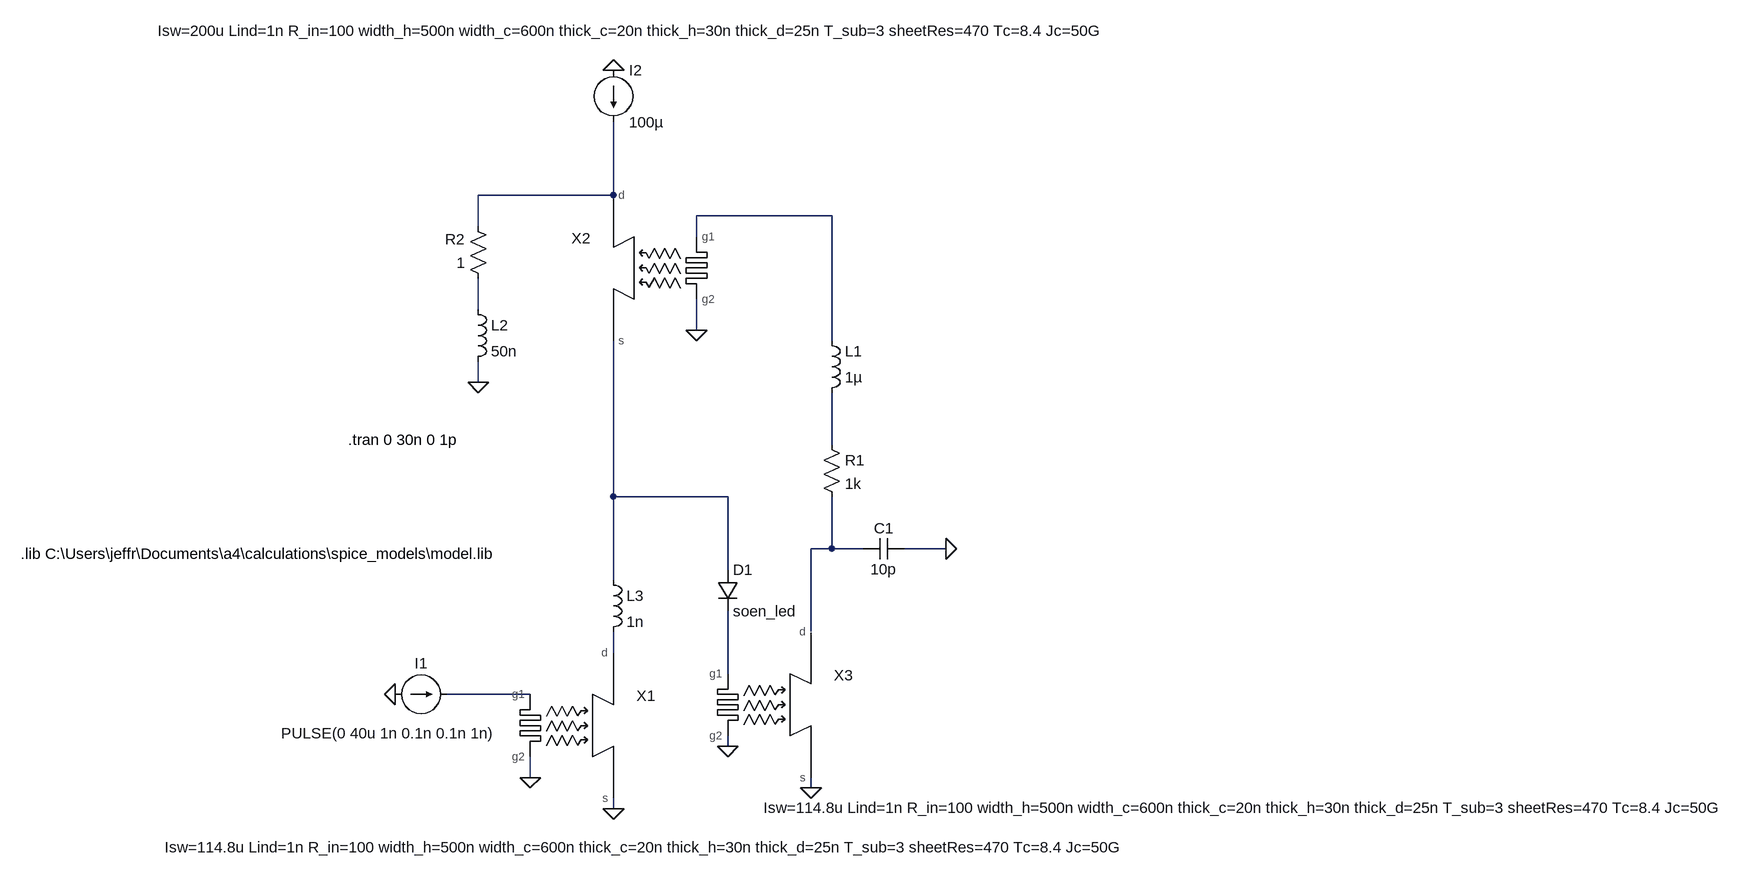
[diagram p0: schematic transmitter_hTron.asc]
transmitter_hTron.asc, the LTspice schematic file:
Version 4
SHEET 1 2100 832
WIRE 288 -448 288 -560
WIRE 288 -448 80 -448
WIRE 624 -416 416 -416
WIRE 80 -400 80 -448
WIRE 416 -384 416 -416
WIRE 80 -272 80 -320
WIRE 416 -240 416 -288
WIRE 624 -224 624 -416
WIRE 80 -160 80 -192
WIRE 624 -64 624 -144
WIRE 288 16 288 -224
WIRE 464 16 288 16
WIRE 624 96 624 16
WIRE 624 96 592 96
WIRE 672 96 624 96
WIRE 800 96 736 96
WIRE 464 128 464 16
WIRE 288 144 288 16
WIRE 592 224 592 96
WIRE 288 256 288 224
WIRE 464 288 464 192
WIRE 160 320 32 320
WIRE 464 400 464 384
WIRE 160 448 160 416
WIRE 592 464 592 448
WIRE 288 496 288 480
FLAG -48 320 0
FLAG 288 -640 0
FLAG 160 448 0
FLAG 288 496 0
FLAG 800 96 0
FLAG 416 -240 0
FLAG 80 -160 0
FLAG 464 400 0
FLAG 592 464 0
SYMBOL hTron_debug 288 368 R0
WINDOW 39 57 203 Bottom 2
SYMATTR SpiceLine Isw=114.8u Lind=1n R_in=100 width_h=500n width_c=600n thick_c=20n thick_h=30n thick_d=25n T_sub=3 sheetRes=470 Tc=8.4 Jc=50G
SYMATTR InstName X1
SYMBOL current -48 320 R270
WINDOW 0 32 40 VTop 2
WINDOW 3 -44 -10 VBottom 2
WINDOW 123 0 0 Left 0
WINDOW 39 0 0 Left 0
SYMATTR InstName I1
SYMATTR Value PULSE(0 40u 1n 0.1n 0.1n 1n)
SYMBOL current 288 -640 R0
WINDOW 123 0 0 Left 0
WINDOW 39 0 0 Left 0
SYMATTR InstName I2
SYMATTR Value 100µ
SYMBOL res 608 -80 R0
SYMATTR InstName R1
SYMATTR Value 1k
SYMBOL cap 672 112 R270
WINDOW 0 32 32 VTop 2
WINDOW 3 0 32 VBottom 2
SYMATTR InstName C1
SYMATTR Value 10p
SYMBOL ind 608 -128 M180
WINDOW 0 36 80 Left 2
WINDOW 3 36 40 Left 2
SYMATTR InstName L1
SYMATTR Value 1µ
SYMBOL hTron_debug 288 -336 M0
WINDOW 39 -36 -349 Bottom 2
SYMATTR SpiceLine Isw=200u Lind=1n R_in=100 width_h=500n width_c=600n thick_c=20n thick_h=30n thick_d=25n T_sub=3 sheetRes=470 Tc=8.4 Jc=50G
SYMATTR InstName X2
SYMBOL res 96 -304 R180
WINDOW 0 36 76 Left 2
WINDOW 3 36 40 Left 2
SYMATTR InstName R2
SYMATTR Value 1
SYMBOL ind 64 -288 R0
SYMATTR InstName L2
SYMATTR Value 50n
SYMBOL ind 272 128 R0
SYMATTR InstName L3
SYMATTR Value 1n
SYMBOL diode 448 128 R0
SYMATTR InstName D1
SYMATTR Value soen_led
SYMBOL hTron_debug 592 336 R0
WINDOW 39 674 174 Bottom 2
SYMATTR SpiceLine Isw=114.8u Lind=1n R_in=100 width_h=500n width_c=600n thick_c=20n thick_h=30n thick_d=25n T_sub=3 sheetRes=470 Tc=8.4 Jc=50G
SYMATTR InstName X3
TEXT -120 -72 Left 2 !.tran 0 30n 0 1p
TEXT -624 104 Left 2 !.lib C:\\Users\\jeffr\\Documents\\a4\\calculations\\spice_models\\model.lib

The netlist it stands for:
* transmitter_hTron.asc
XX1 N007 N009 0 0 hTron_debug params: hTron_debug Isw=114.8u Lind=1n R_in=100 width_h=500n width_c=600n thick_c=20n thick_h=30n thick_d=25n T_sub=3 sheetRes=470 Tc=8.4 Jc=50G  ; pins d g1 g2 s
I1 0 N009 PULSE(0 40u 1n 0.1n 0.1n 1n)
I2 0 N001 100µ
R1 N004 N006 1k
C1 N006 0 10p
L1 N004 N002 1µ
XX2 N001 N002 0 N005 hTron_debug params: hTron_debug Isw=200u Lind=1n R_in=100 width_h=500n width_c=600n thick_c=20n thick_h=30n thick_d=25n T_sub=3 sheetRes=470 Tc=8.4 Jc=50G  ; pins d g1 g2 s
R2 N003 N001 1
L2 N003 0 50n
L3 N005 N007 1n
D1 N005 N008 soen_led
XX3 N006 N008 0 0 hTron_debug params: hTron_debug Isw=114.8u Lind=1n R_in=100 width_h=500n width_c=600n thick_c=20n thick_h=30n thick_d=25n T_sub=3 sheetRes=470 Tc=8.4 Jc=50G  ; pins d g1 g2 s
.model D D
.lib standard.dio
.tran 0 30n 0 1p
.lib C:\Users\jeffr\Documents\a4\calculations\spice_models\model.lib
.backanno
.end